# Altium schematic sheet ESP32_USBC_CHARGER.SchDoc
size B; SheetNumber: 2; SheetTotal: 2
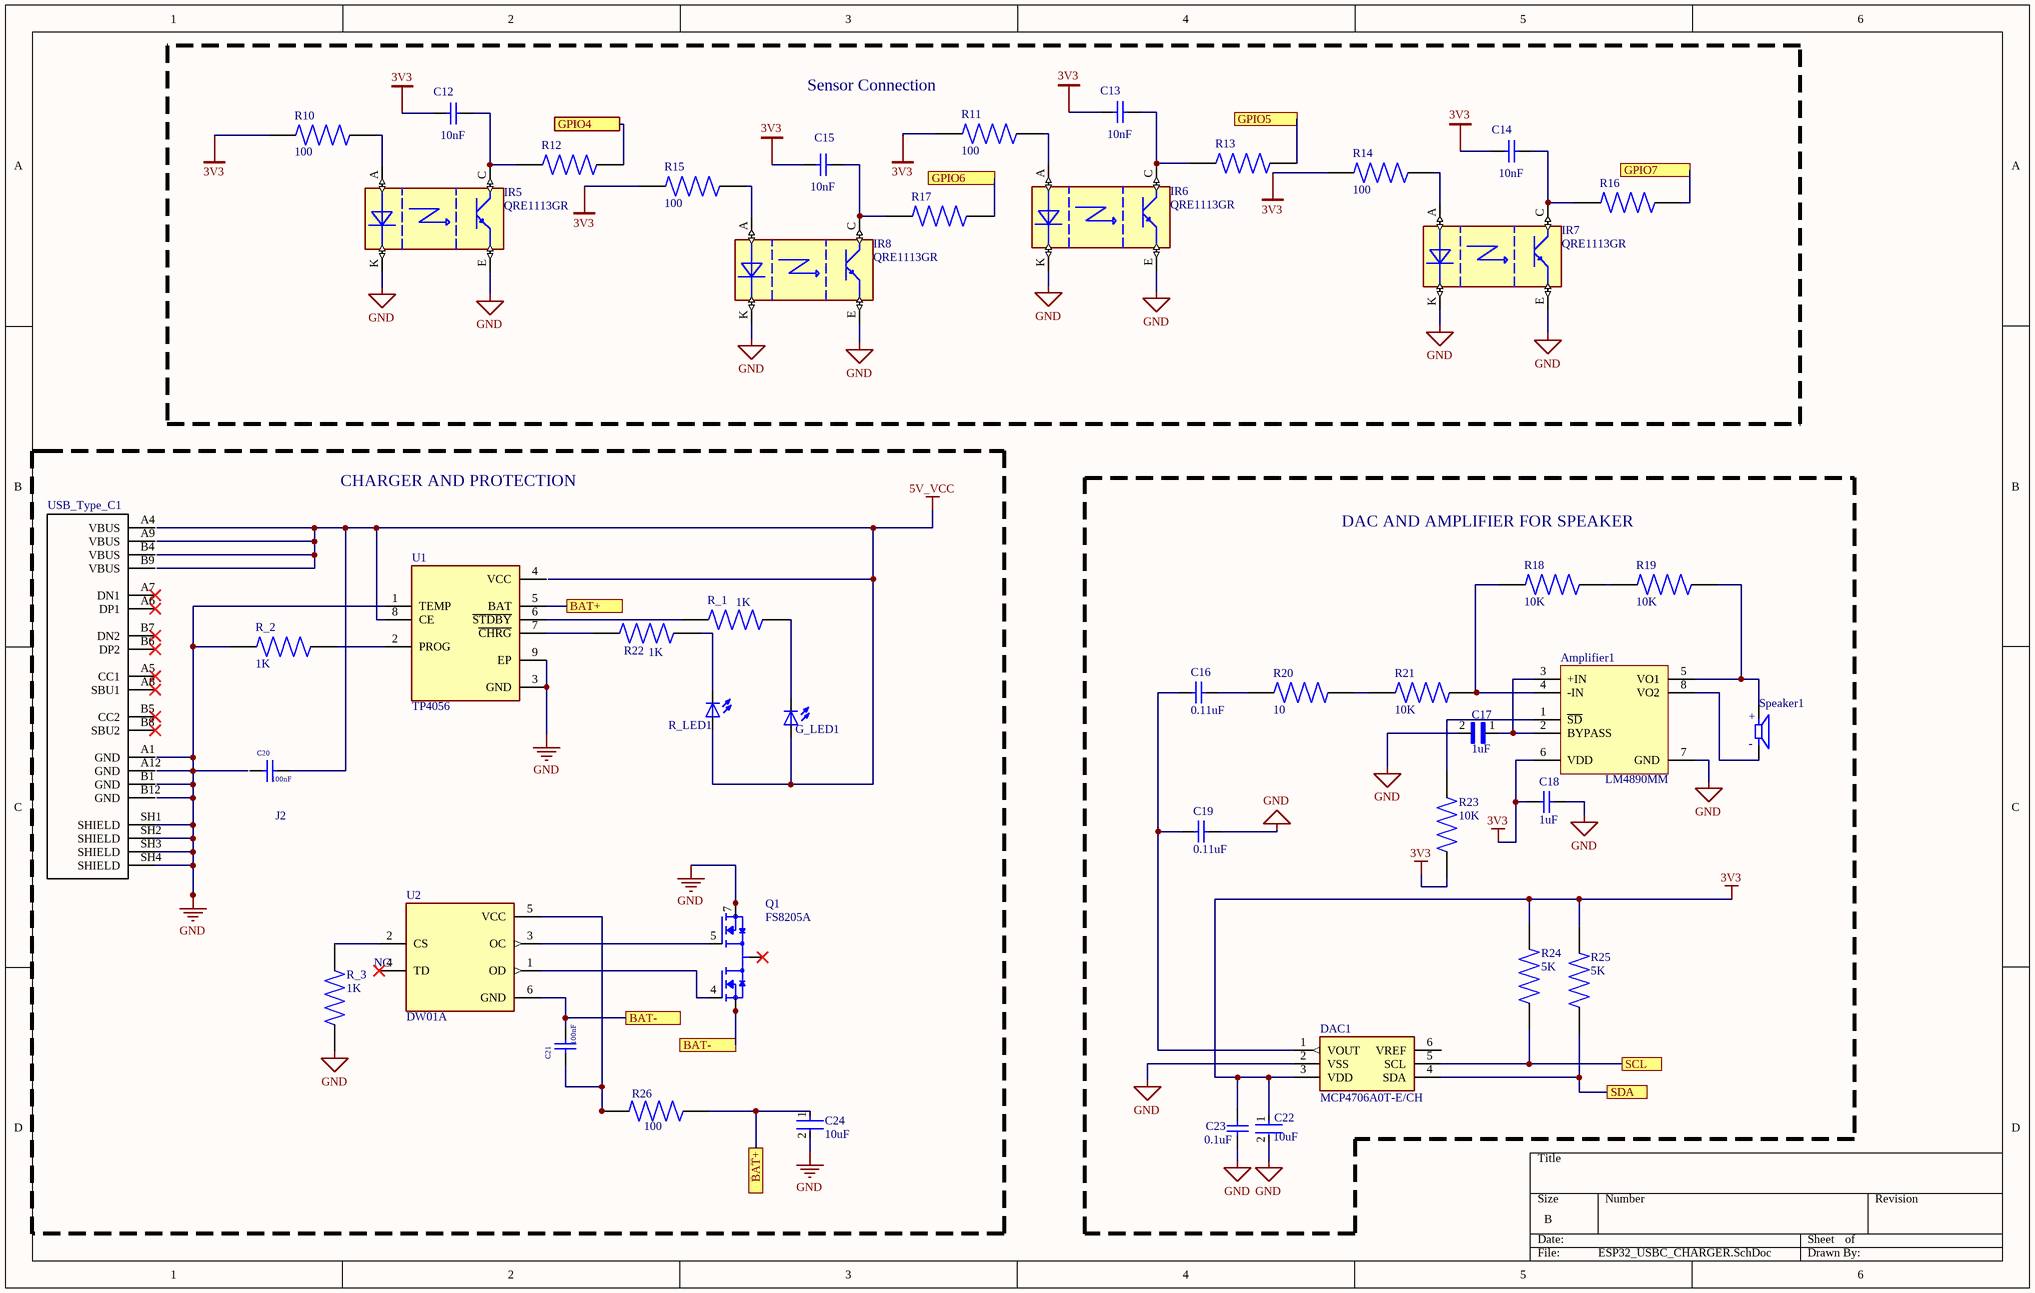
[diagram p0: ESP32_USBC_CHARGER.SchDoc]

## Parts
Amplifier1  LM4890MM  [DGK0008A_M]
C12  10nF  [WCAP-CSGP_0805_L2W1.25H1.25]
C13  10nF  [WCAP-CSGP_0805_L2W1.25H1.25]
C14  10nF  [WCAP-CSGP_0805_L2W1.25H1.25]
C15  10nF  [WCAP-CSGP_0805_L2W1.25H1.25]
C16  0.11uF  [CAPC1608X90X35NL10T15]
C17  1uF  [CAPC1608X90N]
C18  1uF  [CAPC1608X90X35NL10T15]
C19  0.11uF  [CAPC1608X90X35NL10T15]
C20  100nF  [WCAP-CSGP_0402_L1W0.5H0.5]
C21  100nF  [WCAP-CSGP_0402_L1W0.5H0.5]
C22  10uF  [CAPC2012X88N]
C23  0.1uF  [CAPC1608X90X35NL10T15]
C24  10uF  [CAPC2012X88N]
DAC1  MCP4706A0T-E/CH  [SOT95P270X145-6N]
G_LED1  TLLR4400  [LED3MM]  (value not drawn)
IR5  QRE1113GR  [4LEADSMD]
IR6  QRE1113GR  [4LEADSMD]
IR7  QRE1113GR  [4LEADSMD]
IR8  QRE1113GR  [4LEADSMD]
Q1  FS8205A  [SOP65P640X120-8N]
R10  100  [RESC6432X75N]
R11  100  [RESC6432X75N]
R12  220  [RESC1005X35N]  (value not drawn)
R13  220  [RESC1005X35N]  (value not drawn)
R14  100  [RESC6432X75N]
R15  100  [RESC6432X75N]
R16  220  [RESC1005X35N]  (value not drawn)
R17  220  [RESC1005X35N]  (value not drawn)
R18  10K  [RESC1005X40N]
R19  10K  [RESC1005X40N]
R20  10  [RESC1005X40N]
R21  10K  [RESC1005X40N]
R22  1K  [RES_ERJU06F1001V]
R23  10K  [RESC1005X40N]
R24  5K  [RESC3126X65N]
R25  5K  [RESC3126X65N]
R26  100  [RESC6432X75N]
R_1  1K  [RES_ERJU06F1001V]
R_2  1K  [RES_ERJU06F1001V]
R_3  1K  [RES_ERJU06F1001V]
R_LED1  TLLR4400  [LED3MM]  (value not drawn)
Speaker1  CVS-1508  [SPKR_CVS-1508]  (value not drawn)
U1  TP4056  [SOP127P600X175-9N]
U2  DW01A  [SOT95P280X145-6N]
USB_Type_C1  UJ20-C-H-G-SMT-TR  [*CUI_UJ20-C-H-G-SMT-TR_UJ20-C-H-G-SMT-TR(Primary)]  (value not drawn)

## Blocks framed on the sheet
Sensor Connection: C12-C15 IR5-IR8 R10-R17
CHARGER AND PROTECTION: C20 C21 C24 G_LED1 Q1 R22 R26 R_1-R_3 R_LED1 U1 U2 USB_Type_C1
DAC AND AMPLIFIER FOR SPEAKER: Amplifier1 C16-C19 C22 C23 DAC1 R18-R21 R23-R25 Speaker1

## Ports
BAT+, BAT-, GPIO4, GPIO5, GPIO6, GPIO7, SCL, SDA

## Nets
3V3: Amplifier1.6(VDD) C12.1 C13.1 C14.1 C15.1 C18.1 C22.1 C23.2 DAC1.3(VDD) R10.1 R11.1 R14.1 R15.1 R23.1 R24.2 R25.2
5V_VCC: C20.2 G_LED1.A R_LED1.A U1.8(CE)
GND: Amplifier1.7(GND) C17.2 C18.2 C19.2 C22.2 C23.1 C24.2 DAC1.2(VSS) IR5.E IR5.K IR6.E IR6.K IR7.E IR7.K IR8.E IR8.K Q1.6(S2) Q1.7(S2) R_2.1 R_3.1 U1.1(TEMP) U1.3(GND) U1.9(EP) USB_Type_C1.SH1(SHIELD) USB_Type_C1.SH2(SHIELD) USB_Type_C1.SH3(SHIELD) USB_Type_C1.SH4(SHIELD)
BAT+: C24.1 R26.2 U1.5(BAT) ; port BAT+
BAT-: C21.2 Q1.2(S1) Q1.3(S1) U2.6(GND) ; port BAT-
GPIO4: R12.2 ; port GPIO4
GPIO5: R13.2 ; port GPIO5
GPIO6: R17.2 ; port GPIO6
GPIO7: R16.2 ; port GPIO7
SCL: DAC1.5(SCL) R24.1 ; port SCL
SDA: DAC1.4(SDA) R25.1 ; port SDA
NetAmplifier1_1: Amplifier1.1(~{SD}) R23.2
NetAmplifier1_2: Amplifier1.2(BYPASS) Amplifier1.3(+IN) C17.1
NetAmplifier1_4: Amplifier1.4(-IN) R18.1 R21.2
NetAmplifier1_5: Amplifier1.5(VO1) R19.2 Speaker1.P
NetAmplifier1_8: Amplifier1.8(VO2) Speaker1.M
NetC12_2: C12.2 IR5.C R12.1
NetC13_2: C13.2 IR6.C R13.1
NetC14_2: C14.2 IR7.C R16.1
NetC15_2: C15.2 IR8.C R17.1
NetC16_1: C16.1 C19.1 DAC1.1(VOUT)
NetC16_2: C16.2 R20.1
NetC21_1: C21.1 R26.1 U2.5(VCC)
NetG_LED1_K: G_LED1.K(C) R_1.2
NetIR5_A: IR5.A R10.2
NetIR6_A: IR6.A R11.2
NetIR7_A: IR7.A R14.2
NetIR8_A: IR8.A R15.2
NetQ1_1: Q1.1(D12) Q1.8(D12)
NetQ1_4: Q1.4(G1) U2.1(OD)
NetQ1_5: Q1.5(G2) U2.3(OC)
NetR18_2: R18.2 R19.1
NetR20_2: R20.2 R21.1
NetR22_1: R22.1 U1.7(~{CHRG})
NetR22_2: R22.2 R_LED1.K(C)
NetR_1_1: R_1.1 U1.6(~{STDBY})
NetR_2_2: R_2.2 U1.2(PROG)
NetR_3_2: R_3.2 U2.2(CS)

Not connected (* = marked no-connect by the designer): C20 1; DAC1 6(VREF); U1 4(VCC); U2 4(TD)*; USB_Type_C1 A1(GND) A4(VBUS) A5(CC1)* A6(DP1)* A7(DN1)* A8(SBU1)* A9(VBUS) A12(GND) B1(GND) B4(VBUS) B5(CC2)* B6(DP2)* B7(DN2)* B8(SBU2)* B9(VBUS) B12(GND)

## Notes on the sheet
- (near C20) J2
- (near U2) NC
- (in symbol CVS-1508) +; -

## Library data of the parts
Amplifier1 = CMP-0057-00556-3: 1W Audio Power Amplifier, 8-pin Mini SOIC; Manufacturer: Texas Instruments; PackageTopMarking: ZXTT*G90; CompType: Audio IC; PowerWise: N; ComponentLink1URL: http://www.ti.com/general/docs/lit/getliterature.tsp?genericPartNumber=LM4890&fileType=pdf; ComponentLink1Description: Datasheet URL; RoHS: N; PackageReference: DGK0008A; PackageDescription: MINI SOIC, .118 x .118 x .034in, 8 Lead, .0256in Pitch; PinCount: 8; Code_JEDEC: MO-187-AA
C12-C15 = 885012007009: WCAP-CSGP Multilayer Ceramic Chip Capacitor, General Purpose, size 0805, NP0, 10nF, 10V; Manufacturer: Wurth Elektronik; Case/Size Code: 0805; Capacitance Tolerance: +/-5%; Insulation Resistance: 10GΩ; Q Factor: 1000; Technical Reference: NP00805103J010DFCT10000; Manufacturer Part Number: 885012007009; Category: Multilayer Ceramic Chip Capacitors; Match Code: WCAP-CSGP; ComponentLink1Description: Website Link; ComponentLink1URL: https://www.we-online.com/redexpert/article/885012007009?ad; ComponentLink2Description: Datasheet Link; ComponentLink2URL: https://www.we-online.com/redexpert/spec/885012007009?ad; Mount: Surface Mount; Min Operating Temperature: -55°C; Max Operating Temperature: 125°C; Packaging: Tape and Reel; Length: 2mm; Width: 1.25mm; Height: 1.25mm; Capacitance: 10nF; Ceramic Type: NP0; Rated Voltage (DC): 10V
C16 C18 C19 C23 = CMP-2100-03643-1: Chip Capacitor, 0.1 uF, +/- 10%, 50 V, -55 to 125 degC, 0603 (1608 Metric), RoHS, Tape and Reel; Manufacturer: Murata; Dielectric Material: Ceramic; Voltage Rating: 50V; Capacitance: 100nF; Dielectric: X7R; Insulation Resistance: 10GR; Case Code (Metric): 1608; Lead Free: LeadFree; Depth: 0.8mm; Number of Pins: 2; Radiation Hardening: No; Case/Package: 0603; Manufacturer URL: http://www.murata.com/; Packaging: TapeandReel; Length: 1.6mm; Contact Plating: Tin; Datasheet URL: http://psearch.en.murata.com/capacitor/product/GRM188R71H104KA93%23.pdf; Tolerance: 10%; Case Code (Imperial): 0603; Min Operating Temperature: -55degC; RoHSCompliant: true; Voltage: 50V; Termination: SMD/SMT; Mount: SurfaceMount; Material: Ceramic; Package Quantity: 1; Height: 0.8mm; Thickness: 0.035inch; REACH SVHC: NoSVHC; Max Operating Temperature: 125degC; Width: 0.8mm; Package Reference: 0603; Voltage Rating (DC): 50V; Datasheet Version: 42675.0; Package Description: 2-Pin Surface Mount Device, Body 1.6 x 0.8 mm
C17 = CL10B105KO8NNNC: 1ÂµF Â±10% 16V Ceramic Capacitor X7R 0603 (1608 Metric); MF: Samsung Electro-Mechanics; Digi-Key_Part_Number: 1276-1019-1-ND; Arrow_Electronics-Purchase-URL: https://snapeda.com/shop?store=Arrow+Electronics&id=3597999; Package: 0603 Samsung; DigiKey-Purchase-URL: https://snapeda.com/shop?store=DigiKey&id=3597999; SnapEDA_Link: https://www.snapeda.com/parts/CL10B105KO8NNNC/Samsung%20Electro-Mechanics/view-part/3597999/?ref=snap; MP: CL10B105KO8NNNC; Value: *
C20 C21 = 885012105001: WCAP-CSGP Multilayer Ceramic Chip Capacitor, General Purpose, size 0402, X5R, 100nF, 6.3V; Manufacturer: Wurth Elektronik; Case/Size Code: 0402; Capacitance Tolerance: +/-20%; Dissipation Factor: 10%; Insulation Resistance: 1GΩ; Technical Reference: X5R0402104M6R3DFCT10000; Manufacturer Part Number: 885012105001; Category: Multilayer Ceramic Chip Capacitors; Match Code: WCAP-CSGP; ComponentLink1Description: Website Link; ComponentLink1URL: https://www.we-online.com/redexpert/article/885012105001?ad; ComponentLink2Description: Datasheet Link; ComponentLink2URL: https://www.we-online.com/redexpert/spec/885012105001?ad; Mount: Surface Mount; Min Operating Temperature: -55°C; Max Operating Temperature: 85°C; Packaging: Tape and Reel; Length: 1mm; Width: 0.5mm; Height: 0.5mm; Capacitance: 100nF; Ceramic Type: X5R; Rated Voltage (DC): 6.3V
C22 C24 = CMP-13271-004224-1: Cap Ceramic 10uF 25V X5R ±20% Pad SMD 0603 +85°C T/R; Width: 0.031inch; Voltage Rating: 25V; Length: 0.063inch; Case Code (Metric): 1608; Dielectric: X5R; Termination: Wraparound; Capacitance: 10uF; Lead Free: Lead Free; Mount: Surface Mount; Package Quantity: 1; Case Code (Imperial): 0603; Thickness: 0.035inch; Packaging: Tape and Reel; Contact Plating: Tin; Min Operating Temperature: -55°C; Tolerance: 20%; Max Operating Temperature: 85°C; Case/Package: 0603
DAC1 = MCP4706A0T-E_CH: IC, OUTPUT D/A CONVERTER;8-BIT W/EEPROM & I2C INTERFACE;-40 TO 125C;SOT23 | Microchip Technology Inc. MCP4706A0T-E/CH; SnapEDA_Link: https://www.snapeda.com/parts/MCP4706A0T-E/CH/Microchip/view-part/?ref=snap; Package: SOT-23-6 Microchip; Value: *; MF: Microchip; MP: MCP4706A0T-E/CH; Check_prices: https://www.snapeda.com/parts/MCP4706A0T-E/CH/Microchip/view-part/?ref=eda
G_LED1 R_LED1 = TLLR4400: Red 619nm LED Indication - Discrete 1.9V Radial; MF: Vishay; SnapEDA_Link: https://www.snapeda.com/parts/TLLR4400/Vishay+Semiconductor+Opto+Division/view-part/?ref=snap; Package: None; Value: *; MP: TLLR4400; Check_prices: https://www.snapeda.com/parts/TLLR4400/Vishay+Semiconductor+Opto+Division/view-part/?ref=eda
IR5-IR8 = QRE1113GR: Optical Switches, Reflective, Phototransistor Output Reflective Sensor; MF: SparkFun; SnapEDA_Link: https://www.snapeda.com/parts/QRE1113/SparkFun/view-part/?ref=snap; Package: None; Value: *; MP: QRE1113; Check_prices: https://www.snapeda.com/parts/QRE1113/SparkFun/view-part/?ref=eda
Q1 = FS8205A: MF: Fortune Semiconductor; SnapEDA_Link: https://www.snapeda.com/parts/FS8205A/Fortune+Semiconductor/view-part/?ref=snap; Package: Package; Value: *; MP: FS8205A; Check_prices: https://www.snapeda.com/parts/FS8205A/Fortune+Semiconductor/view-part/?ref=eda
R10 R11 R14 R15 R26 = CRS2512-FX-1000ELF: CRS Series Anti-surge Resistor 2512 Case 100Ohms 2W +/-100ppm/degC | Bourns CRS2512-FX-1000ELF; SnapEDA_Link: https://www.snapeda.com/parts/CRS2512-FX-1000ELF/Bourns/view-part/?ref=snap; Package: 6432 Bourns; Value: *; MF: Bourns; MP: CRS2512-FX-1000ELF; Check_prices: https://www.snapeda.com/parts/CRS2512-FX-1000ELF/Bourns/view-part/?ref=eda
R12 R13 R16 R17 = CPF0402B220RE1: Resistencia de pelÃ­cula delgada de precisiÃ³n SMD, carcasa 0402, 220 ohmios +/-0,1 %, 063 W +/-25 ppm/C ¦ TE Connectivity CPF0402B220RE1; Power_Rating: .063 W; Voltage_Rating: 25 V; Tolerance: .1%; SnapEDA_Link: https://www.snapeda.com/parts/CPF0402B220RE1/TE+Connectivity/view-part/?ref=snap; Package: 0402; Resistance: 220; Value: *; MF: TE Connectivity; MP: CPF0402B220RE1; EU_RoHS_Compliance: Compliant; Check_prices: https://www.snapeda.com/parts/CPF0402B220RE1/TE+Connectivity/view-part/?ref=eda
R18-R21 R23 = CRG0402J10K/10: CRG0402 chip resistor,10K 5% 0.063W | TE Connectivity CRG0402J10K/10; Power_Rating: .063 W; Voltage_Rating: 50 V; SnapEDA_Link: https://www.snapeda.com/parts/CRG0402J10K/10/TE+Connectivity+Passive+Product/view-part/?ref=snap; Package: 0402; Resistance: 10K; Value: *; MF: TE Connectivity; MP: CRG0402J10K/10; EU_RoHS_Compliance: Compliant with Exemptions; Tolerance: 5%; Check_prices: https://www.snapeda.com/parts/CRG0402J10K/10/TE+Connectivity+Passive+Product/view-part/?ref=eda
R22 R_1-R_3 = ERJU06F1001V: Res Thick Film 0805 1K Ohm 1% 0.125W(1/8W) Â±100ppm/C Sulfur Resistant Pad SMD Automotive T/R; MF: Panasonic; Availability: No availability data; Value: *; Check_prices: https://www.snapeda.com/parts/ERJU06F1001V/Panasonic/view-part/5742057/?ref=eda; Package: 2012-2 Panasonic; SnapEDA_Link: https://www.snapeda.com/parts/ERJU06F1001V/Panasonic/view-part/5742057/?ref=snap; Price: None; MP: ERJU06F1001V
R24 R25 = RL73H2ER33FTD: RL73H 2E R33 1% 5K RL; Power_Rating: .5 W; Resistance: 33; MF: TE Connectivity; SnapEDA_Link: https://www.snapeda.com/parts/RL73H2ER33FTD/TE+Connectivity/view-part/?ref=snap; Package: 1210; Value: *; MP: RL73H2ER33FTD; EU_RoHS_Compliance: Compliant with Exemptions; Tolerance: 1%; Check_prices: https://www.snapeda.com/parts/RL73H2ER33FTD/TE+Connectivity/view-part/?ref=eda
Speaker1 = CVS-1508: 15 mm, Round Frame, 0.3 W, 8 Ohm, Neodymium Magnet, Mylar Cone; MF: CUI Devices; Digi-Key_Part_Number: 102-2498-ND; DigiKey-Purchase-URL: https://snapeda.com/shop?store=DigiKey&id=681641; Package: CUI Inc.; Value: *; SnapEDA_Link: https://www.snapeda.com/parts/CVS-1508/CUI%20Devices/view-part/681641/?ref=snap; MP: CVS-1508; CUI_purchase_URL: https://www.cuidevices.com/product/audio/speakers/miniature-_10-mm~40-mm_/cvs-1508?utm_source=snapeda.com&utm_medium=referral&utm_campaign=snapedaBOM
U1 = TP4056: Complete single cell Li-Ion battery with a constant current / constant voltage linear charger; MF: NanJing Top Power ASIC Corp.; Check_prices: https://www.snapeda.com/parts/TP4056/NanJing+Top+Power+ASIC+Corp./view-part/?ref=eda; SnapEDA_Link: https://www.snapeda.com/parts/TP4056/NanJing+Top+Power+ASIC+Corp./view-part/?ref=snap; Price: None; Availability: Not in stock; Package: Package; MP: TP4056; Value: *
U2 = DW01A: One Cell Lithium-ion/Polymer Battery Protection IC; MF: Fortune Semiconductor; SnapEDA_Link: https://www.snapeda.com/parts/DW01A/Fortune+Semiconductor/view-part/?ref=snap; Package: SOT-23-6 Fortune Semiconductor; Value: *; MP: DW01A; Check_prices: https://www.snapeda.com/parts/DW01A/Fortune+Semiconductor/view-part/?ref=eda
USB_Type_C1 = UJ20-C-H-G-SMT-TR: SnapEDA_Link: https://www.snapeda.com/parts/UJ20-C-H-G-SMT-TR/Same+Sky/view-part/?ref=snap; Check_prices: https://www.snapeda.com/parts/UJ20-C-H-G-SMT-TR/Same+Sky/view-part/?ref=eda; Value: *